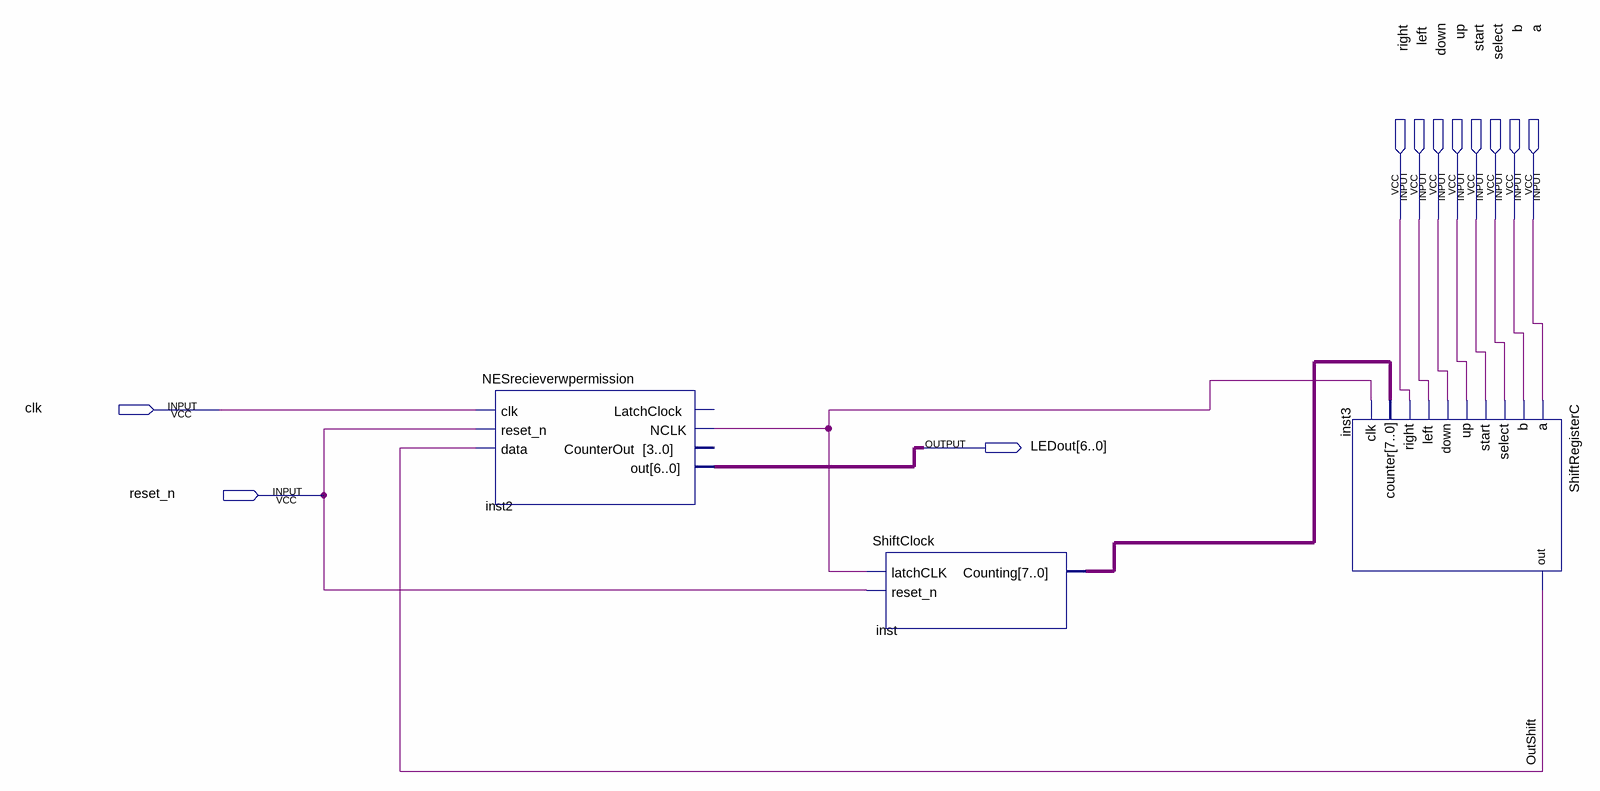
[diagram p0: schematic sheet]
// Quartus schematic NESControllerDriver.bdf as structural Verilog: 3 symbols, 11 pins
module NESControllerDriver (
  input  right,
  input  left,
  input  down,
  input  up,
  input  start,
  input  select,
  input  b,
  input  a,
  input  clk,
  input  reset_n,
  output [6:0] LEDout
);

  wire inst2_nclk, OutShift;
  wire [7:0] inst_counting;

  NESrecieverwpermission inst2 (
    .clk(clk), .reset_n(reset_n), .data(OutShift), .NCLK(inst2_nclk), .out(LEDout));  // open: LatchClock, CounterOut
  ShiftClock inst (.latchCLK(inst2_nclk), .reset_n(reset_n), .Counting(inst_counting));
  ShiftRegisterC inst3 (
    .a(a), .b(b), .select(select), .start(start), .up(up), .down(down), .left(left), .right(right),
    .counter(inst_counting), .clk(inst2_nclk), .out(OutShift));
endmodule
